# EAGLE schematic XMICRO-BREAKOUT-CARD (EAGLE 6.3)
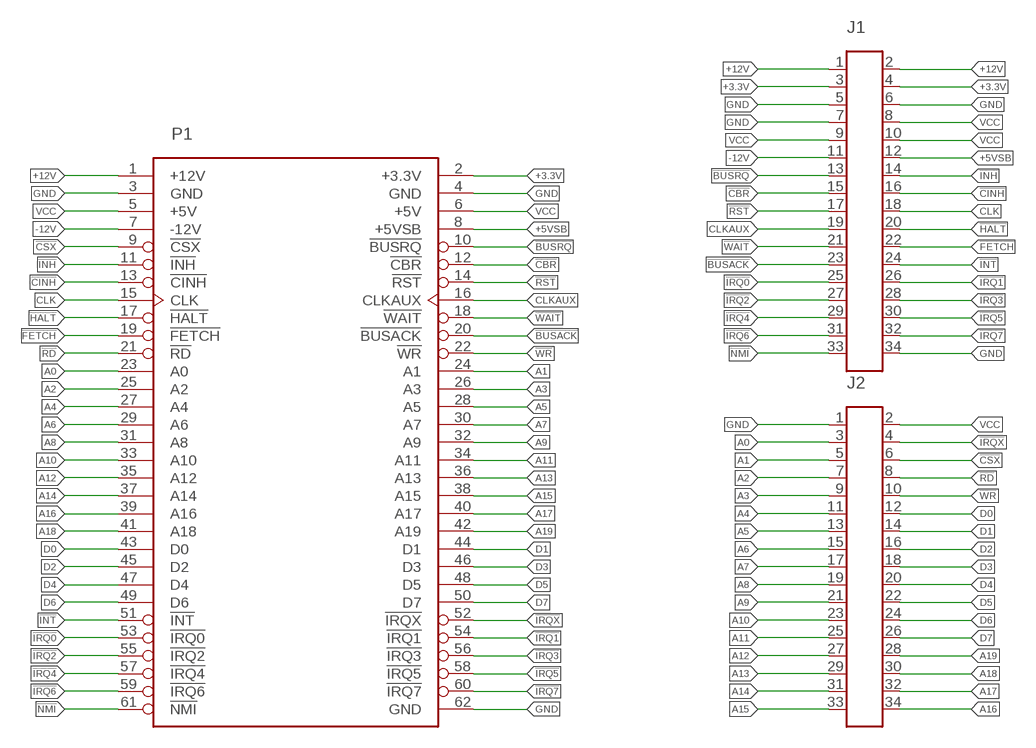
[diagram p0: schematic, sheet 1]

## Parts
J1  HDR-17X2  [HDR-17X2S]
J2  HDR-17X2  [HDR-17X2S]
P1  XMICRO-BUS-PHYSICAL-EDGE62M  [EDGE62M]

## Nets
!BUSACK: J1.23 P1.20(!BUSACK)
!BUSRQ: J1.13 P1.10(!BUSRQ)
!CBR: J1.15 P1.12(!CBR)
!CINH: J1.16 P1.13(!CINH)
!CSX: J2.6 P1.9(!CSX)
!FETCH: J1.22 P1.19(!FETCH)
!HALT: J1.20 P1.17(!HALT)
!INH: J1.14 P1.11(!INH)
!INT: J1.24 P1.51(!INT)
!IRQ0: J1.25 P1.53(!IRQ0)
!IRQ1: J1.26 P1.54(!IRQ1)
!IRQ2: J1.27 P1.55(!IRQ2)
!IRQ3: J1.28 P1.56(!IRQ3)
!IRQ4: J1.29 P1.57(!IRQ4)
!IRQ5: J1.30 P1.58(!IRQ5)
!IRQ6: J1.31 P1.59(!IRQ6)
!IRQ7: J1.32 P1.60(!IRQ7)
!IRQX: J2.4 P1.52(!IRQX)
!NMI: J1.33 P1.61(!NMI)
!RD: J2.8 P1.21(!RD)
!RST: J1.17 P1.14(!RST)
!WAIT: J1.21 P1.18(!WAIT)
!WR: J2.10 P1.22(!WR)
+3.3V: J1.3 J1.4 P1.2(+3.3V)
+5VSB: J1.12 P1.8(+5VSB)
+12V: J1.1 J1.2 P1.1(+12V)
-12V: J1.11 P1.7(-12V)
A0: J2.3 P1.23(A0)
A1: J2.5 P1.24(A1)
A2: J2.7 P1.25(A2)
A3: J2.9 P1.26(A3)
A4: J2.11 P1.27(A4)
A5: J2.13 P1.28(A5)
A6: J2.15 P1.29(A6)
A7: J2.17 P1.30(A7)
A8: J2.19 P1.31(A8)
A9: J2.21 P1.32(A9)
A10: J2.23 P1.33(A10)
A11: J2.25 P1.34(A11)
A12: J2.27 P1.35(A12)
A13: J2.29 P1.36(A13)
A14: J2.31 P1.37(A14)
A15: J2.33 P1.38(A15)
A16: J2.34 P1.39(A16)
A17: J2.32 P1.40(A17)
A18: J2.30 P1.41(A18)
A19: J2.28 P1.42(A19)
CLK: J1.18 P1.15(CLK)
CLKAUX: J1.19 P1.16(CLKAUX)
D0: J2.12 P1.43(D0)
D1: J2.14 P1.44(D1)
D2: J2.16 P1.45(D2)
D3: J2.18 P1.46(D3)
D4: J2.20 P1.47(D4)
D5: J2.22 P1.48(D5)
D6: J2.24 P1.49(D6)
D7: J2.26 P1.50(D7)
GND: J1.5 J1.6 J1.7 J1.34 J2.1 P1.3(GND) P1.4(GND) P1.62(GND)
VCC: J1.8 J1.9 J1.10 J2.2 P1.5(+5V) P1.6(+5V)

## Library data of the parts
J1 J2 = Custom:HDR-17X2
P1 = Custom:XMICRO-BUS-PHYSICAL

## Net classes
1 GND: width 0.254 mm, clearance 0.381 mm